# EAGLE schematic W5200 Ethernet Shield (EAGLE 6.1)
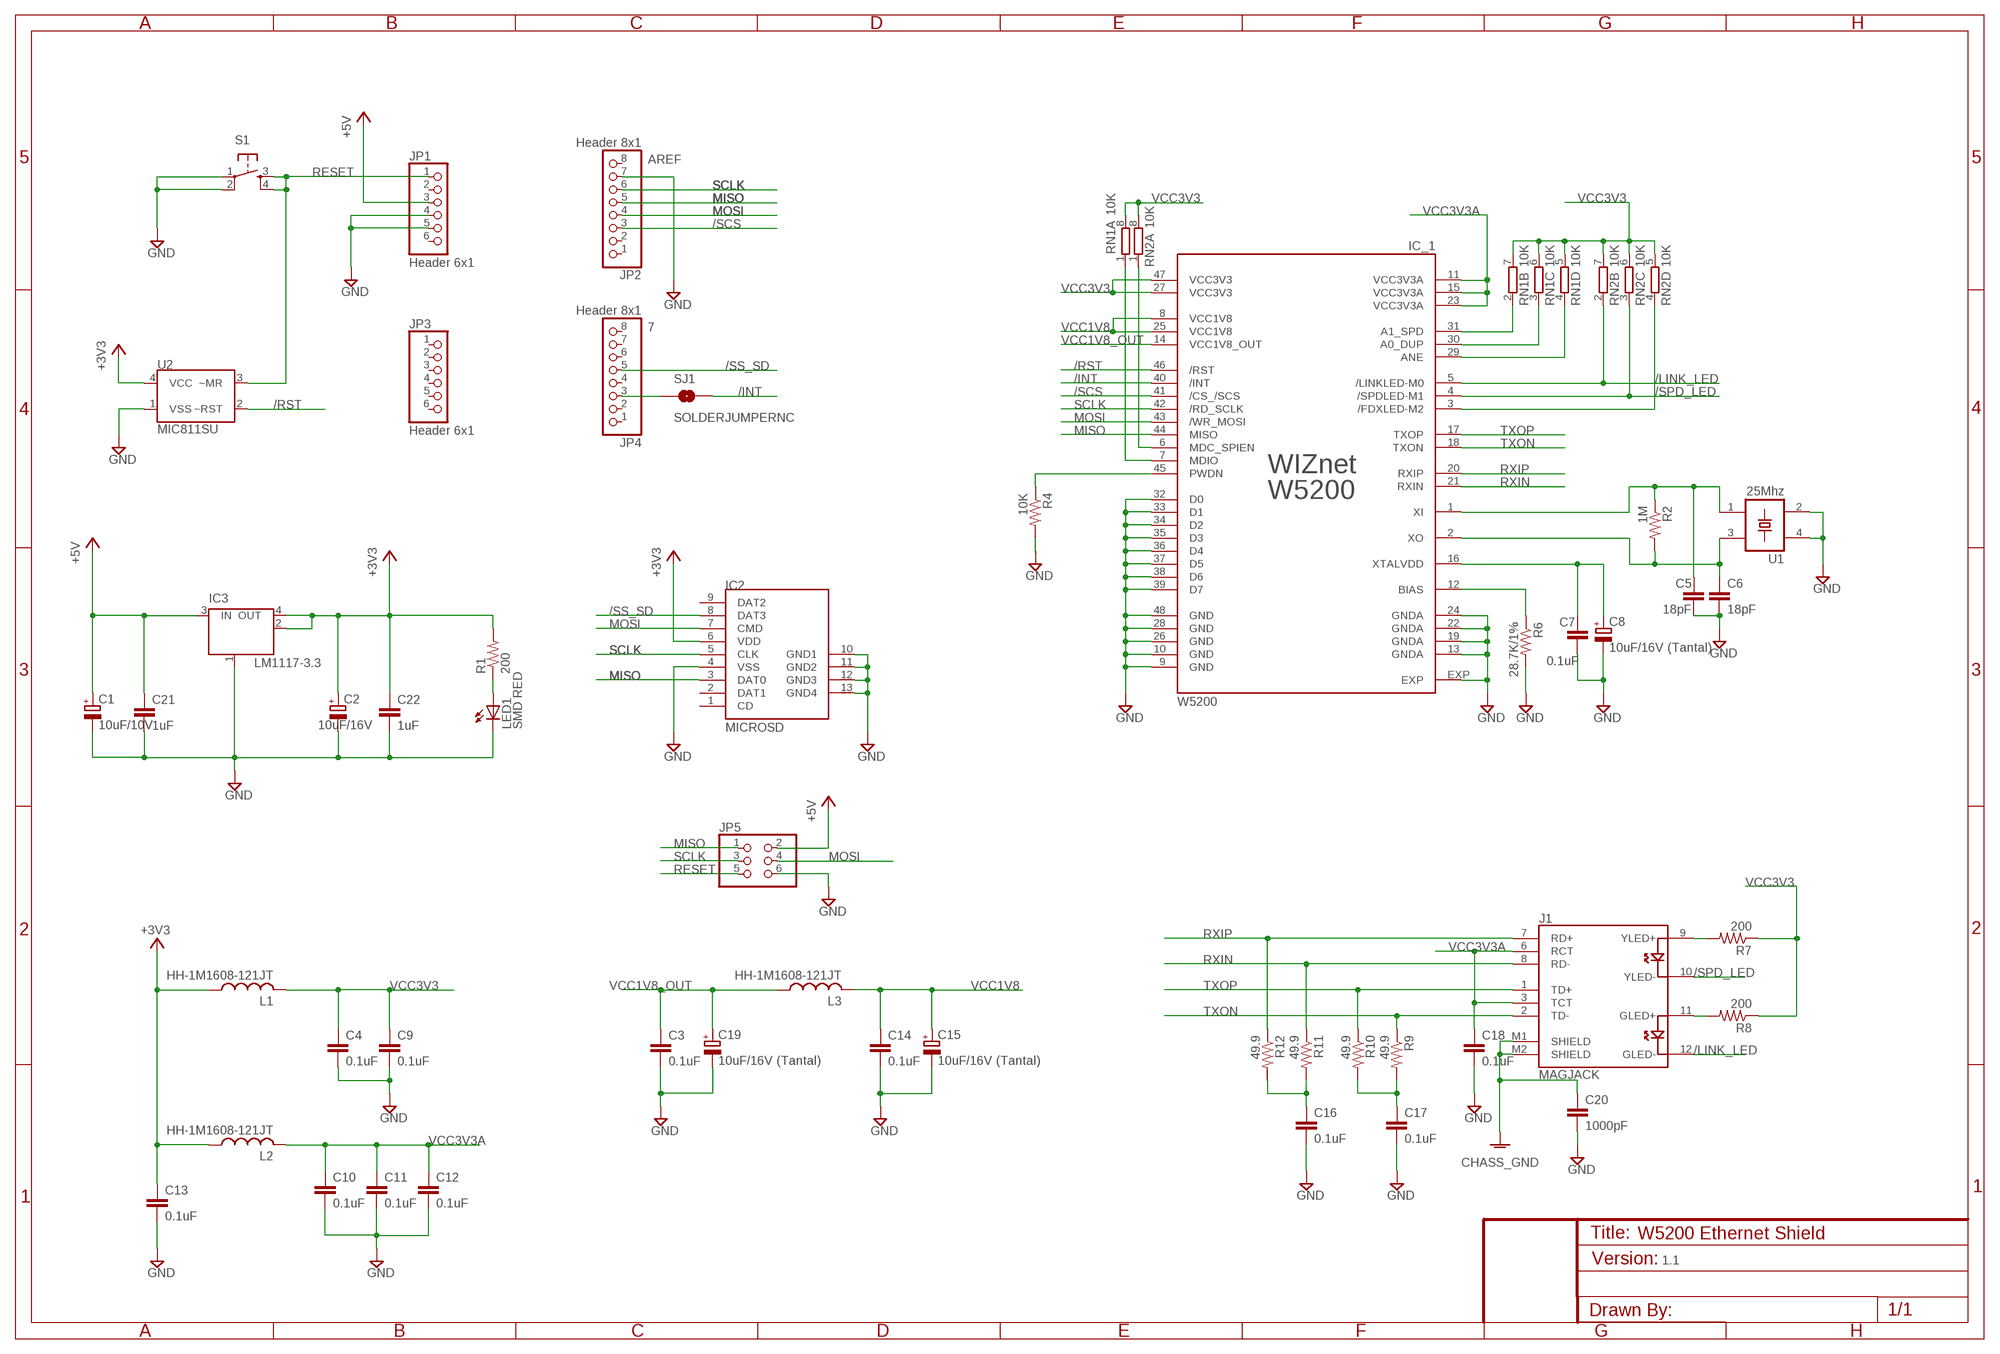
[diagram p0: schematic, sheet 1]

## Parts
C1  10uF/10V  CPOL-EUCT3216  [CT3216]
C2  10uF/16V  CPOL-EUCT3216  [CT3216]
C3  0.1uF  C-EUC0603  [C0603]
C4  0.1uF  C-EUC0603  [C0603]
C5  18pF  C-EUC0603  [C0603]
C6  18pF  C-EUC0603  [C0603]
C7  0.1uF  C-EUC0603  [C0603]
C8  10uF/16V (Tantal)  CPOL-EUCT3216  [CT3216]
C9  0.1uF  C-EUC0603  [C0603]
C10  0.1uF  C-EUC0603  [C0603]
C11  0.1uF  C-EUC0603  [C0603]
C12  0.1uF  C-EUC0603  [C0603]
C13  0.1uF  C-EUC0603  [C0603]
C14  0.1uF  C-EUC0603  [C0603]
C15  10uF/16V (Tantal)  CPOL-EUCT3216  [CT3216]
C16  0.1uF  C-EUC0603  [C0603]
C17  0.1uF  C-EUC0603  [C0603]
C18  0.1uF  C-EUC0603  [C0603]
C19  10uF/16V (Tantal)  CPOL-EUCT3216  [CT3216]
C20  1000pF  C-EUC3225  [C3225]
C21  1uF  C-EUC0603  [C0603]
C22  1uF  C-EUC0603  [C0603]
IC2  MICROSD  MSD_SYMBOL_MICROSD  [MSD_SYMBOL_MSDPAC]
IC3  LM1117-3.3  MC33269ST-3.3T3  [SOT223]
IC_1  W5200  [QFN48]
J1  MAGJACK  [MAGJACK]
JP1  Header 6x1  PINHD-1X6  [1X06]
JP2  Header 8x1  PINHD-1X8  [1X08]
JP3  Header 6x1  PINHD-1X6  [1X06]
JP4  Header 8x1  PINHD-1X8  [1X08]
JP5  PINHD-2X3  [2X03]
L1  HH-1M1608-121JT  L-USL2012C  [L2012C]
L2  HH-1M1608-121JT  L-USL2012C  [L2012C]
L3  HH-1M1608-121JT  L-USL2012C  [L2012C]
LED1  SMD RED  LEDCHIP-LED0805  [CHIP-LED0805]
R1  200  R-US_R0603  [R0603]
R2  1M  R-US_R0603  [R0603]
R4  10K  R-US_R0603  [R0603]
R6  28.7K/1%  R-US_R0603  [R0603]
R7  200  R-US_R0603  [R0603]
R8  200  R-US_R0603  [R0603]
R9  49.9  R-US_R0603  [R0603]
R10  49.9  R-US_R0603  [R0603]
R11  49.9  R-US_R0603  [R0603]
R12  49.9  R-US_R0603  [R0603]
RN1  10K  4R-NEXBV8V  [EXBV8V]
RN2  10K  4R-NEXBV8V  [EXBV8V]
S1  TAC_SWITCHSMD  [TACTILE_SWITCH_SMD]
SJ1  SOLDERJUMPERNC  [SJ_2S]
U1  25Mhz  CRYSTAL  [CRYSTAL]
U2  MIC811SU  STM811  [SOT143]

## Nets
+3V3 [power]: C2.+ C13.1 C22.1 IC2.6(VDD) IC3.2(OUT) IC3.4(OUT) L1.1 L2.1 R1.2 U2.4(VCC)
+5V [power]: C1.+ C21.1 IC3.3(IN) JP1.3 JP5.2
/INT: IC_1.40(/INT) SJ1.2
/LINK_LED: IC_1.5(/LINKLED-M0) J1.12(GLED-) RN2.2
/RST: IC_1.46(/RST) U2.2(~RST)
/SCS: IC_1.41(/CS_/SCS) JP2.3
/SPD_LED: IC_1.4(/SPDLED-M1) J1.10(YLED-) RN2.3
/SS_SD: IC2.8(DAT3) JP4.5
GND [power]: C1.- C2.- C3.2 C4.2 C5.2 C6.2 C7.2 C8.- C9.2 C10.2 C11.2 C12.2 C13.2 C14.2 C15.- C16.2 C17.2 C18.2 C19.- C20.2 C21.2 C22.2 IC2.4(VSS) IC2.10(GND1) IC2.11(GND2) IC2.12(GND3) IC2.13(GND4) IC3.1(GND/ADJ) IC_1.9(GND) IC_1.10(GND) IC_1.13(GNDA) IC_1.19(GNDA) IC_1.22(GNDA) IC_1.24(GNDA) IC_1.26(GND) IC_1.28(GND) IC_1.32(D0) IC_1.33(D1) IC_1.34(D2) IC_1.35(D3) IC_1.36(D4) IC_1.37(D5) IC_1.38(D6) IC_1.39(D7) IC_1.48(GND) IC_1.EXP JP1.4 JP1.5 JP2.7 JP5.6 LED1.C R4.2 R6.2 S1.1 S1.2 U1.2(GND0) U1.4(GND1) U2.1(VSS)
GNDA: C20.1 J1.M1(SHIELD) J1.M2(SHIELD) ; supply symbol labelled CHASS_GND
MISO: IC2.3(DAT0) IC_1.44(MISO) JP2.5 JP5.1
MOSI: IC2.7(CMD) IC_1.43(/WR_MOSI) JP2.4 JP5.4
N$1: JP4.3 SJ1.1
N$2: IC_1.31(A1_SPD) RN1.2
N$3: C6.1 IC_1.2(XO) R2.2 U1.3(OUT)
N$4: C5.1 IC_1.1(XI) R2.1 U1.1(TRI)
N$5: IC_1.30(A0_DUP) RN1.3
N$6: IC_1.29(ANE) RN1.4
N$7: J1.9(YLED+) R7.2
N$8: J1.11(GLED+) R8.2
N$10: IC_1.7(MDIO) RN1.1
N$12: IC_1.12(BIAS) R6.1
N$13: C7.1 C8.+ IC_1.16(XTALVDD)
N$14: C17.1 R9.2 R10.2
N$15: LED1.A R1.1
N$16: C16.1 R11.2 R12.2
N$17: IC_1.6(MDC_SPIEN) RN2.1
N$20: IC_1.3(/FDXLED-M2) RN2.4
PWDN: IC_1.45(PWDN) R4.1
RESET: JP1.1 JP5.5 S1.3 S1.4 U2.3(~MR)
RXIN: IC_1.21(RXIN) J1.8(RD-) R11.1
RXIP: IC_1.20(RXIP) J1.7(RD+) R12.1
SCLK: IC2.5(CLK) IC_1.42(/RD_SCLK) JP2.6 JP5.3
TXON: IC_1.18(TXON) J1.2(TD-) R9.1
TXOP: IC_1.17(TXOP) J1.1(TD+) R10.1
VCC1V8 [power]: C14.1 C15.+ IC_1.8(VCC1V8) IC_1.25(VCC1V8) L3.2
VCC1V8_OUT [power]: C3.1 C19.+ IC_1.14(VCC1V8_OUT) L3.1
VCC3V3 [power]: C4.1 C9.1 IC_1.27(VCC3V3) IC_1.47(VCC3V3) L1.2 R7.1 R8.1 RN1.5 RN1.6 RN1.7 RN1.8 RN2.5 RN2.6 RN2.7 RN2.8
VCC3V3A [power]: C10.1 C11.1 C12.1 C18.1 IC_1.11(VCC3V3A) IC_1.15(VCC3V3A) IC_1.23(VCC3V3A) J1.3(TCT) J1.6(RCT) L2.2
Unconnected: IC2.1(CD) IC2.2(DAT1) IC2.9(DAT2) JP1.2 JP1.6 JP2.1 JP2.2 JP2.8 JP3.1 JP3.2 JP3.3 JP3.4 JP3.5 JP3.6 JP4.1 JP4.2 JP4.4 JP4.6 JP4.7 JP4.8

## Notes on the sheet
- AREF
- SCLK
- MISO
- MOSI
- 7
- SCLK
- MISO
- 1.1

## Library data of the parts
C1 C2 C8 C15 C19 = rcl:CPOL-EU: POLARIZED CAPACITOR, European symbol
C3-C7 C9-C14 C16-C18 C20-C22 = rcl:C-EU: CAPACITOR, European symbol
IC2 = _SRAW5200 Ethernet shield_CADNIX_placement2_1:MSD_SYMBOL_MICROSD
IC3 = linear:MC33269ST*: Adjustable Output Low Dropout Voltage Regulator 800 mA Source: http://www.onsemi.com/pub/Collateral/MC33269-D.PDF
IC_1 = 2012-11-07_WIZnet_5_11_0:W5200: WIZnet W5200 QFN48
J1 = WIZnet_Eagle_Lib_0.1:MAGJACK: RB1-125BAG1A
JP1 JP3 = pinhead:PINHD-1X6: PIN HEADER
JP2 JP4 = pinhead:PINHD-1X8: PIN HEADER
JP5 = pinhead:PINHD-2X3: PIN HEADER
L1-L3 = rcl:L-US: INDUCTOR, American symbol
LED1 = led:LED: LED OSRAM: - CHIPLED LG R971, LG N971, LY N971, LG Q971, LY Q971, LO R971, LY R971 LH N974, LH R974 LS Q976, LO Q976, LY Q976 LO Q996 - Hyper CHIPLED LW Q18S LB Q993, LB Q99A, LB R99A - SideLED LS A670, LO A670, LY A670, LG A670, LP A670 LB A673, LV A673, LT A673, LW A673 LH A674 LY A675 LS A676, LA A676, LO A676, LY A676, LW A676 LS A679, LY A679, LG A679 - Hyper Micro SIDELED® LS Y876, LA Y876, LO Y876, LY Y876 LT Y87S - SmartLED LW L88C, LW L88S LB L89C, LB L89S, LG L890 LS L89K, LO L89K, LY L89K LS L896, LA L896, LO L896, LY L896 - TOPLED LS T670, LO T670, LY T670, LG T670, LP T670 LSG T670, LSP T670, LSY T670, LOP T670, LYG T670 LG T671, LOG T671, LSG T671 LB T673, LV T673, LT T673, LW T673 LH T674 LS T676, LA T676, LO T676, LY T676, LB T676, LH T676, LSB T676, LW T676 LB T67C, LV T67C, LT T67C, LS T67K, LO T67K, LY T67K, LW E67C LS E67B, LA E67B, LO E67B, LY E67B, LB E67C, LV E67C, LT E67C LW T67C LS T679, LY T679, LG T679 LS T770, LO T770, LY T770, LG T770, LP T770 LB T773, LV T773, LT T773, LW T773 LH T774 LS E675, LA E675, LY E675, LS T675 LS T776, LA T776, LO T776, LY T776, LB T776 LHGB T686 LT T68C, LB T68C - Hyper Mini TOPLED® LB M676 - Mini TOPLED Santana® LG M470 LS M47K, LO M47K, LY M47K Source: http://www.osram.convergy.de LUXEON: - LUMILED® LXK2-PW12-R00, LXK2-PW12-S00, LXK2-PW14-U00, LXK2-PW14-V00 LXK2-PM12-R00, LXK2-PM12-S00, LXK2-PM14-U00 LXK2-PE12-Q00, LXK2-PE12-R00, LXK2-PE12-S00, LXK2-PE14-T00, LXK2-PE14-U00 LXK2-PB12-K00, LXK2-PB12-L00, LXK2-PB12-M00, LXK2-PB14-N00, LXK2-PB14-P00, LXK2-PB14-Q00 LXK2-PR12-L00, LXK2-PR12-M00, LXK2-PR14-Q00, LXK2-PR14-R00 LXK2-PD12-Q00, LXK2-PD12-R00, LXK2-PD12-S00 LXK2-PH12-R00, LXK2-PH12-S00 LXK2-PL12-P00, LXK2-PL12-Q00, LXK2-PL12-R00 Source: www.luxeon.com KINGBRIGHT: KA-3528ASYC Source: www.kingbright.com
R1 R2 R4 R6-R12 = resistor:R-US_: RESISTOR, American symbol
RN1 RN2 = resistor-dil:4R-N: Array Chip Resistor Source: RS Component / Phycomp; OC_FARNELL: unknown; OC_NEWARK: unknown
S1 = SparkFun:TAC_SWITCH: Momentary Switch Button commonly used for reset or general input. Spark Fun Electronics SKU : COM-00097
SJ1 = SparkFun:SOLDERJUMPER: Solder Jumper Standard SMD solder jumper. Used to automate production. Two varients : Normally Open and Normally Closed are the same, but have different paste layers. NC will have a large amount of paste and should jumper during reflow.
U1 = 2012-11-07_WIZnet_5_11_0:CRYSTAL: SMD CRYSTAL; OC_FARNELL: unknown; OC_NEWARK: unknown
U2 = SparkFun:STM811: STM811 Reset Circuit Used in the Ethernet Shield

## Net classes
0 default: width 0.3 mm, drill 0.3 mm
1 power: width 0.5 mm, drill 0.5 mm